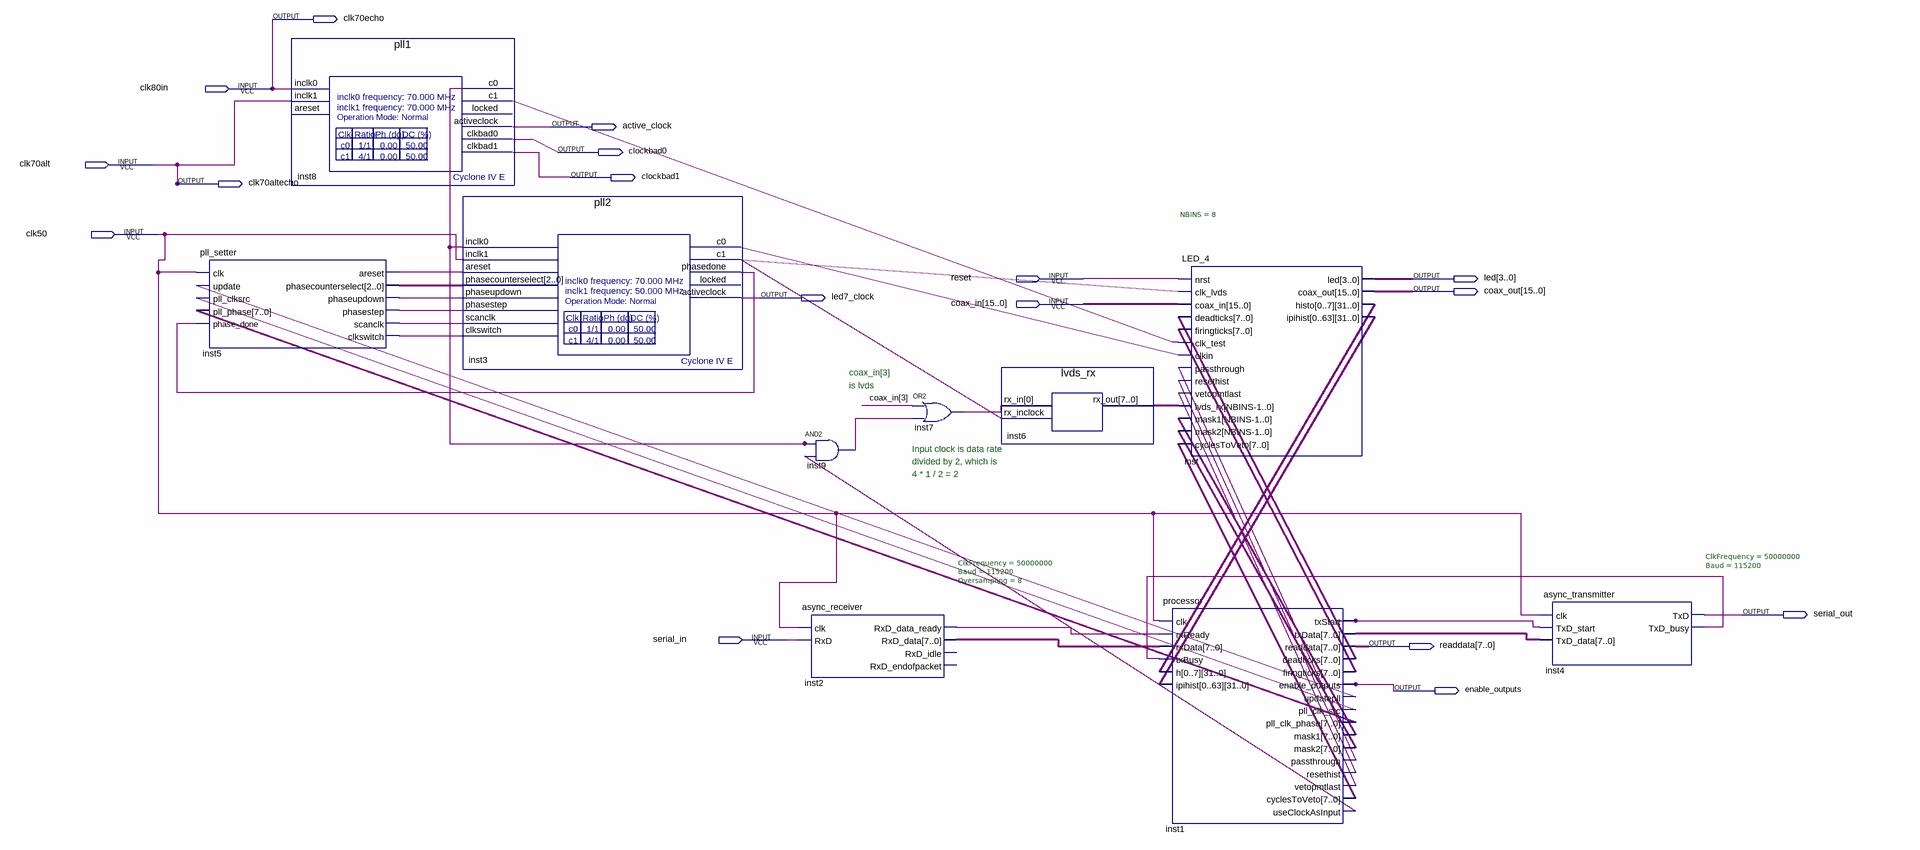
[diagram p0: schematic sheet]
// Quartus schematic coincidence.bdf as structural Verilog: 10 symbols, 17 pins
module coincidence (
  input  clk80in,
  input  clk70alt,
  input  clk50,
  input  reset,
  input  [15:0] coax_in,
  input  serial_in,
  output clk70echo,
  output active_clock,
  output clockbad0,
  output clockbad1,
  output clk70altecho,
  output [3:0] led,
  output [15:0] coax_out,
  output led7_clock,
  output serial_out,
  output [7:0] readdata,
  output enable_outputs
);

  wire inst1_passthrough, inst1_pll_clk_src, inst1_resethist, inst1_txstart, inst1_updatepll,
       inst1_useclockasinput, inst1_vetopmtlast, inst2_rxd_data_ready, inst3_c0, inst3_c1, inst3_phasedone,
       inst4_txd_busy, inst5_areset, inst5_clkswitch, inst5_phasestep, inst5_phaseupdown, inst5_scanclk,
       inst7_out, inst8_c0, inst8_c1, inst9_out;
  wire [2:0] inst5_phasecounterselect;
  wire [7:0] inst1_cyclestoveto, inst1_deadticks, inst1_firingticks, inst1_mask1, inst1_mask2,
       inst1_pll_clk_phase, inst1_txdata, inst2_rxd_data, inst6_rx_out;
  wire [255:0] inst_histo;
  wire [2047:0] inst_ipihist;

  pll_setter inst5 (
    .clk(clk50), .update(inst1_updatepll), .pll_clksrc(inst1_pll_clk_src), .pll_phase(inst1_pll_clk_phase),
    .phase_done(inst3_phasedone), .areset(inst5_areset), .phasecounterselect(inst5_phasecounterselect),
    .phaseupdown(inst5_phaseupdown), .phasestep(inst5_phasestep), .scanclk(inst5_scanclk),
    .clkswitch(inst5_clkswitch));
  pll1 inst8 (
    .inclk0(clk80in), .inclk1(clk70alt), .c0(inst8_c0), .c1(inst8_c1), .activeclock(active_clock),
    .clkbad0(clockbad0), .clkbad1(clockbad1));  // open: areset, locked
  pll2 inst3 (
    .inclk0(inst8_c0), .inclk1(clk50), .areset(inst5_areset), .phasecounterselect(inst5_phasecounterselect),
    .phaseupdown(inst5_phaseupdown), .phasestep(inst5_phasestep), .scanclk(inst5_scanclk),
    .clkswitch(inst5_clkswitch), .c0(inst3_c0), .c1(inst3_c1), .phasedone(inst3_phasedone),
    .activeclock(led7_clock));  // open: locked
  and inst9 (inst9_out, inst8_c0, inst1_useclockasinput);
  async_receiver #(.ClkFrequency(50000000), .Baud(115200), .Oversampling(8)) inst2 (
    .clk(clk50), .RxD(serial_in), .RxD_data_ready(inst2_rxd_data_ready), .RxD_data(inst2_rxd_data));  // open: RxD_idle, RxD_endofpacket
  or inst7 (inst7_out, coax_in[3], inst9_out);
  lvds_rx inst6 (.rx_in(inst7_out), .rx_inclock(inst3_c1), .rx_out(inst6_rx_out));
  processor inst1 (
    .clk(clk50), .rxReady(inst2_rxd_data_ready), .rxData(inst2_rxd_data), .txBusy(inst4_txd_busy),
    .h(inst_histo), .ipihist(inst_ipihist), .txStart(inst1_txstart), .txData(inst1_txdata),
    .readdata(readdata), .deadticks(inst1_deadticks), .firingticks(inst1_firingticks),
    .enable_outputs(enable_outputs), .updatepll(inst1_updatepll), .pll_clk_src(inst1_pll_clk_src),
    .pll_clk_phase(inst1_pll_clk_phase), .mask1(inst1_mask1), .mask2(inst1_mask2),
    .passthrough(inst1_passthrough), .resethist(inst1_resethist), .vetopmtlast(inst1_vetopmtlast),
    .cyclesToVeto(inst1_cyclestoveto), .useClockAsInput(inst1_useclockasinput));
  LED_4 #(.NBINS(8)) inst (
    .nrst(reset), .clk_lvds(inst3_c1), .coax_in(coax_in), .deadticks(inst1_deadticks),
    .firingticks(inst1_firingticks), .clk_test(inst8_c1), .clkin(inst3_c0), .passthrough(inst1_passthrough),
    .resethist(inst1_resethist), .vetopmtlast(inst1_vetopmtlast), .lvds_rx(inst6_rx_out),
    .mask1(inst1_mask1), .mask2(inst1_mask2), .cyclesToVeto(inst1_cyclestoveto), .led(led),
    .coax_out(coax_out), .histo(inst_histo), .ipihist(inst_ipihist));
  async_transmitter #(.ClkFrequency(50000000), .Baud(115200)) inst4 (
    .clk(clk50), .TxD_start(inst1_txstart), .TxD_data(inst1_txdata), .TxD(serial_out),
    .TxD_busy(inst4_txd_busy));

  assign clk70altecho = clk70alt;
  assign clk70echo = clk80in;

  // Notes on the sheet:
  //   coax_in[3]
  //   is lvds
  //   Input clock is data rate
  //   divided by 2, which is
  //   4 * 1 / 2 = 2
endmodule
